# Altium schematic sheet MCU.SchDoc
size A3; SheetNumber: 1; SheetTotal: 2
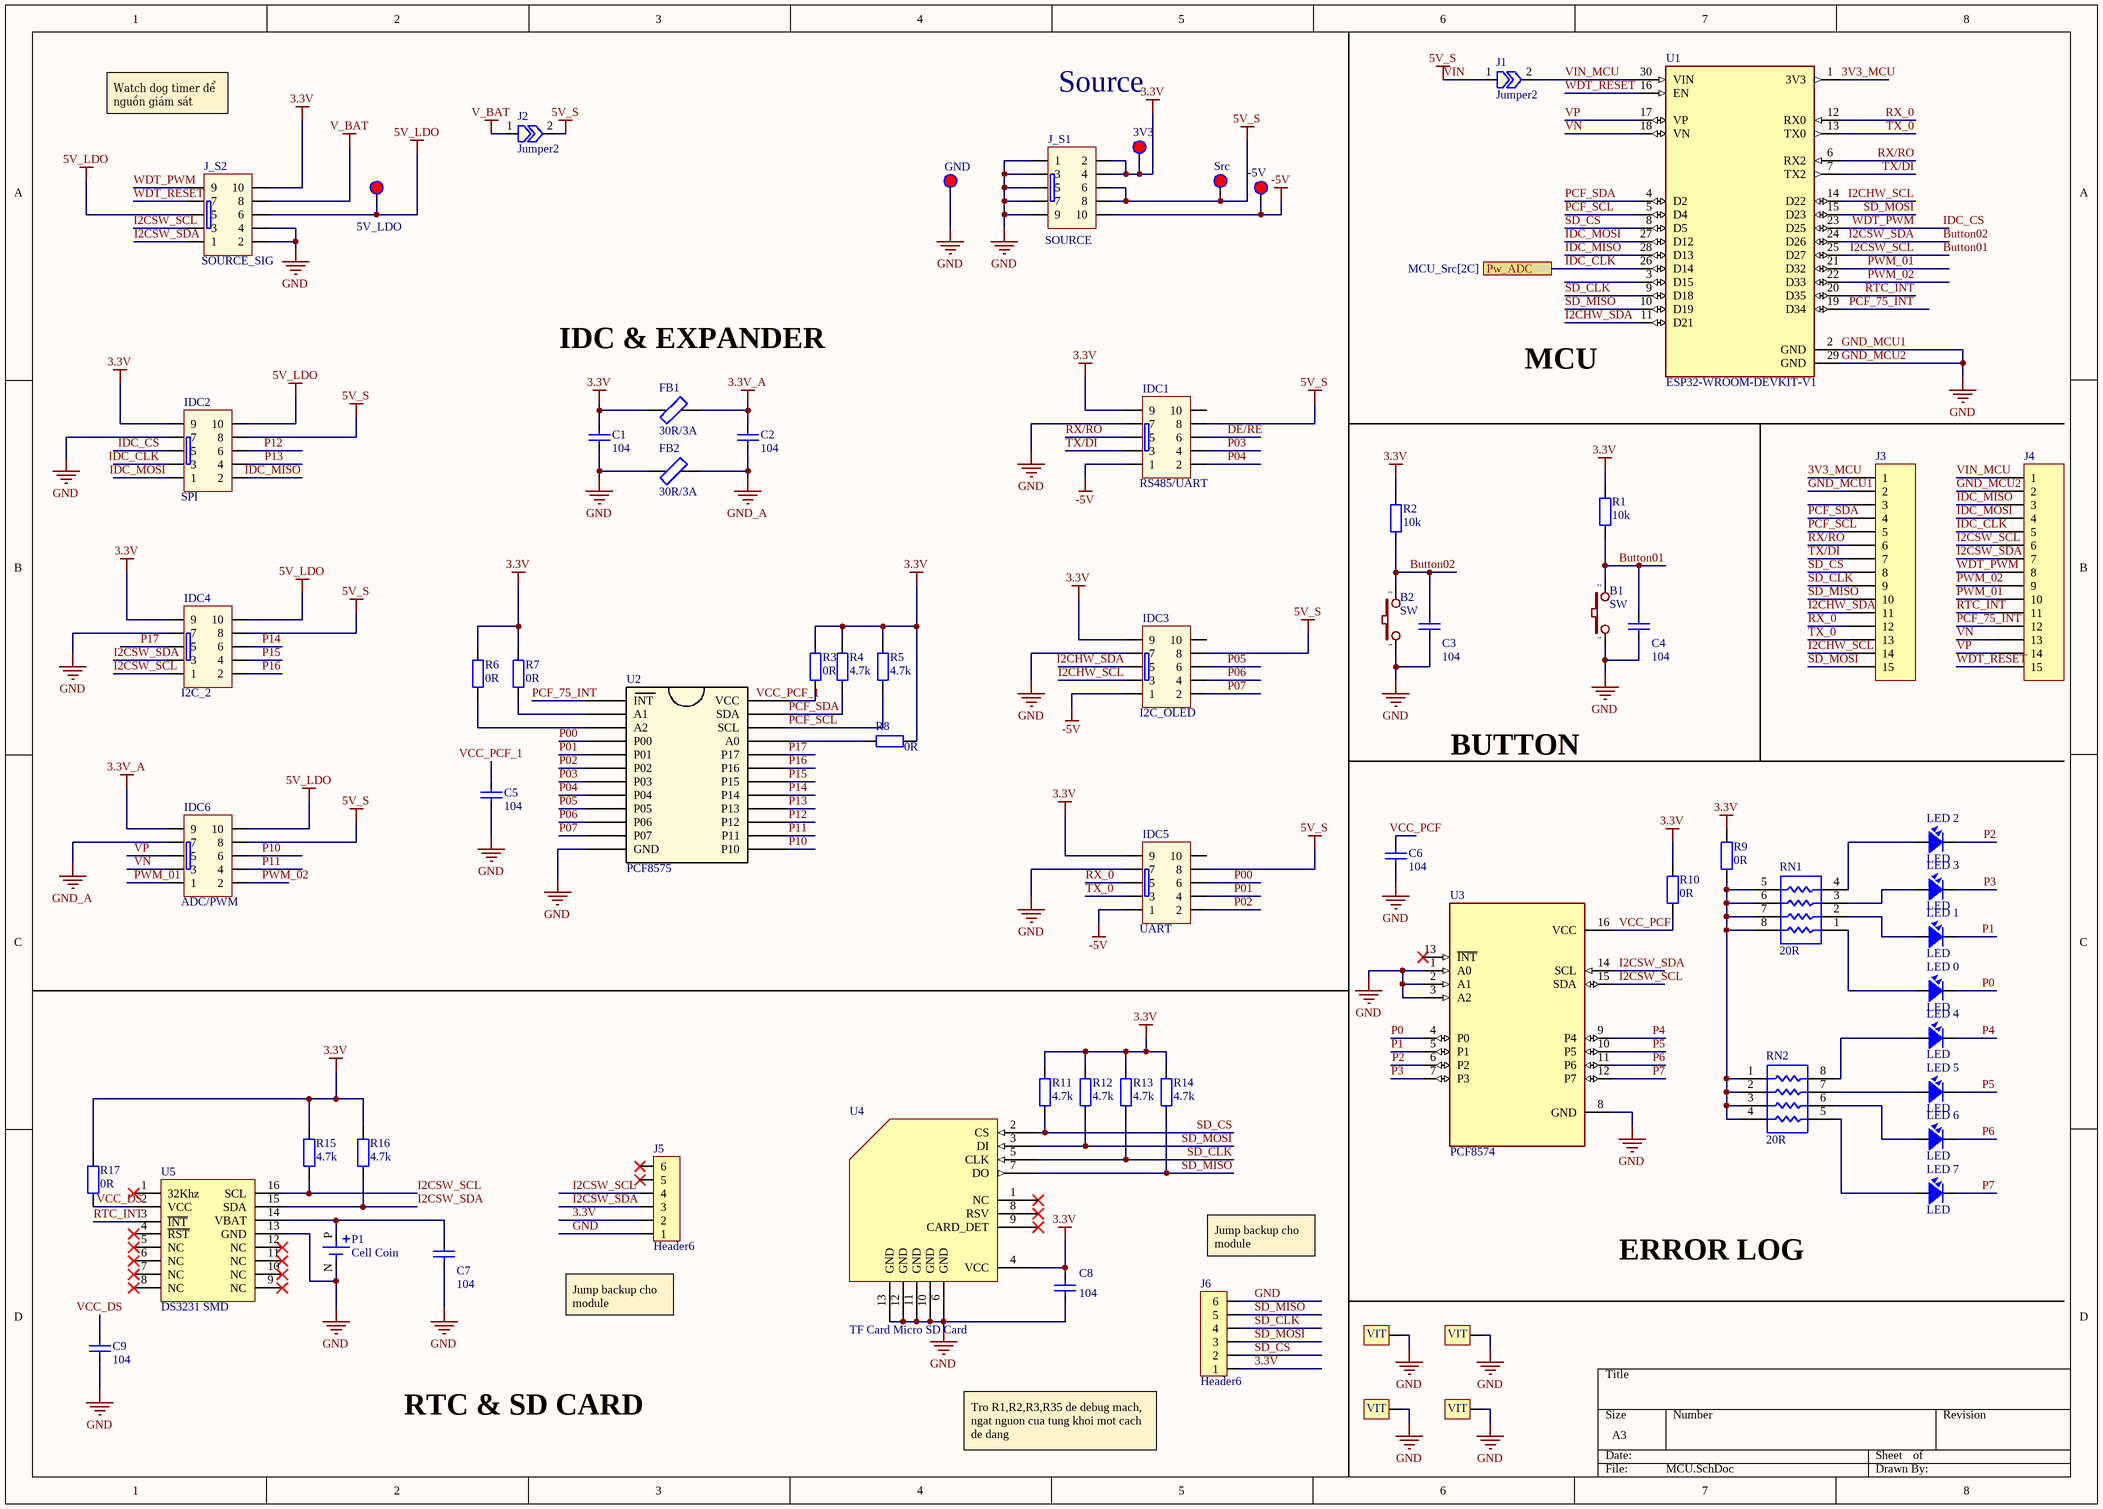
[diagram p0: MCU.SchDoc]

## Parts
B1  SW  [BUTTON NGHIENG]
B2  SW  [BUTTON NGHIENG]
C1  104  [CAP_0603]
C2  104  [CAP_0603]
C3  104  [CAP_0603]
C4  104  [CAP_0603]
C5  104  [CAP_0603]
C6  104  [CAP_0603]
C7  104  [CAP_0603]
C8  104  [CAP_0603]
C9  104  [CAP_0603]
FB1  30R/3A  [RES-SMD-0603]
FB2  30R/3A  [RES-SMD-0603]
IDC1  RS485/UART  [IDC10]
IDC2  SPI  [IDC10]
IDC3  I2C_OLED  [IDC10]
IDC4  I2C_2  [IDC10]
IDC5  UART  [IDC10]
IDC6  ADC/PWM  [IDC10]
J1  Jumper2  [JUMPER2]  (net tie, no BOM)
J2  Jumper2  [RES-SMD-0402]  (net tie, no BOM)
J3  JP15  [JP15-C1T]  (value not drawn)
J4  JP15  [JP15-C1T]  (value not drawn)
J5  Header6  [Header6]
J6  Header6  [JP6]
J_S1  SOURCE  [IDC10]
J_S2  SOURCE_SIG  [IDC10]
LED_0  LED  [LED-0805-Blue]
LED_1  LED  [LED-0805-Blue]
LED_2  LED  [LED-0805-Blue]
LED_3  LED  [LED-0805-Blue]
LED_4  LED  [LED-0805-Blue]
LED_5  LED  [LED-0805-Blue]
LED_6  LED  [LED-0805-Blue]
LED_7  LED  [LED-0805-Blue]
P1  Cell Coin  [S8411 - 45R]
R1  10k  [RES-SMD-0603]
R2  10k  [RES-SMD-0603]
R3  0R  [RES-SMD-0603]
R4  4.7k  [RES-SMD-0603]
R5  4.7k  [RES-SMD-0603]
R6  0R  [RES-SMD-0603]
R7  0R  [RES-SMD-0603]
R8  0R  [RES-SMD-0603]
R9  0R  [RES-SMD-0603]
R10  0R  [RES-SMD-0603]
R11  4.7k  [RES-SMD-0603]
R12  4.7k  [RES-SMD-0603]
R13  4.7k  [RES-SMD-0603]
R14  4.7k  [RES-SMD-0603]
R15  4.7k  [RES-SMD-0603]
R16  4.7k  [RES-SMD-0603]
R17  0R  [RES-SMD-0603]
RN1  20R  [RN4_Dual]
RN2  20R  [RN4_Dual]
TP1  3V3  [Testpoint 50ml]  (net tie, no BOM)
TP2  Src  [Testpoint 50ml]  (net tie, no BOM)
TP3  5V_LDO  [Testpoint 50ml]  (net tie, no BOM)
TP4  GND  [Testpoint 50ml]  (net tie, no BOM)
TP5  -5V  [Testpoint 50ml]  (net tie, no BOM)
U1  ESP32-WROOM-DEVKIT-V1  [ESP32-DEVKIT-V1]
U2  PCF8575  [TSSOP-24]
U3  PCF8574  [SOIC 16 W]
U4  TF Card Micro SD Card  [SD Card TF Card Micro]
U5  DS3231 SMD  [SOIC 16 W]
VIT1  1  [Screw Hole 4mm]  (value not drawn)  (net tie, no BOM)
VIT2  1  [Screw Hole 4mm]  (value not drawn)  (net tie, no BOM)
VIT3  1  [Screw Hole 4mm]  (value not drawn)  (net tie, no BOM)
VIT4  1  [Screw Hole 4mm]  (value not drawn)  (net tie, no BOM)

## Ports
Pw_ADC (see MCU_Src[2C])

## Nets
3.3V: C1.2 C8.2 FB1.1 IDC1.9 IDC2.9 IDC3.9 IDC4.9 IDC5.9 J5.2 J6.1 J_S1.2 J_S1.4 J_S2.10 R1.1 R2.1 R3.1 R4.1 R5.1 R6.2 R7.2 R8.1 R9.2 R10.1 R11.1 R12.1 R13.1 R14.1 R15.1 R16.1 R17.1 TP1.1 U4.4(VCC)
3.3V_A: C2.2 FB1.2 IDC6.9
5V_LDO: IDC2.10 IDC4.10 IDC6.10 J_S2.5 J_S2.6 TP3.1
-5V: IDC1.1 IDC3.1 IDC5.1 J_S1.10 TP5.1
GND: B1.1 B2.1 C1.1 C3.1 C4.1 C5.1 C6.1 C7.1 C8.1 C9.1 FB2.1 IDC1.7 IDC2.7 IDC3.7 IDC4.7 IDC5.7 J3.2 J4.2 J5.1 J6.6 J_S1.1 J_S1.3 J_S1.5 J_S1.7 J_S1.9 J_S2.2 J_S2.4 P1.N(NEG) TP4.1 U1.2(GND) U1.29(GND) U2.12(GND) U3.1(A0) U3.2(A1) U3.3(A2) U3.8(GND) U4.6(GND) U4.10(GND) U4.11(GND) U4.12(GND) U4.13(GND) U5.13(GND) VIT1.VIT1 VIT2.VIT1 VIT3.VIT1 VIT4.VIT1  [also labelled GND_MCU1, GND_MCU2]
GND_A: C2.1 FB2.2 IDC6.7
V_BAT: J2.1 J_S2.8
VIN: IDC1.8 IDC2.8 IDC3.8 IDC4.8 IDC5.8 IDC6.8 J1.1 J2.2 J_S1.6 J_S1.8 TP2.1  [also labelled 5V_S]
3V3_MCU: J3.1 U1.1(3V3)
Button01: B1.2 C4.2 IDC4.1 J4.6 J5.4 J_S2.3 R1.2 R15.2 U1.25(D27) U3.15(SDA) U5.16(SCL)  [also labelled I2CSW_SCL]
Button02: B2.2 C3.2 IDC4.3 J4.7 J5.3 J_S2.1 R2.2 R16.2 U1.24(D26) U3.14(SCL) U5.15(SDA)  [also labelled I2CSW_SDA]
DE/RE: IDC1.6
I2CHW_SCL: IDC3.3 J3.14 U1.14(D22)
I2CHW_SDA: IDC3.5 J3.11 U1.11(D21)
IDC_CLK: IDC2.3 J4.5 U1.26(D14) ; port Pw_ADC
IDC_CS: IDC2.5 J4.8 J_S2.9 U1.23(D25)  [also labelled WDT_PWM]
IDC_MISO: IDC2.2 J4.3 U1.28(D13)
IDC_MOSI: IDC2.1 J4.4 U1.27(D12)
P00: IDC5.6 U2.4(P00)
P0: LED_0.2 U3.4(P0)
P01: IDC5.4 U2.5(P01)
P1: LED_1.2 U3.5(P1)
P02: IDC5.2 U2.6(P02)
P2: LED_2.2 U3.6(P2)
P03: IDC1.4 U2.7(P03)
P3: LED_3.2 U3.7(P3)
P04: IDC1.2 U2.8(P04)
P4: LED_4.2 U3.9(P4)
P05: IDC3.6 U2.9(P05)
P5: LED_5.2 U3.10(P5)
P06: IDC3.4 U2.10(P06)
P6: LED_6.2 U3.11(P6)
P07: IDC3.2 U2.11(P07)
P7: LED_7.2 U3.12(P7)
P10: IDC6.6 U2.13(P10)
P11: IDC6.4 U2.14(P11)
P12: IDC2.6 U2.15(P12)
P13: IDC2.4 U2.16(P13)
P14: IDC4.6 U2.17(P14)
P15: IDC4.4 U2.18(P15)
P16: IDC4.2 U2.19(P16)
P17: IDC4.5 U2.20(P17)
PCF_75_INT: J4.12 U1.19(D34) U2.1(INT)
PCF_SCL: J3.5 R5.2 U1.5(D4) U2.22(SCL)
PCF_SDA: J3.4 R4.2 U1.4(D2) U2.23(SDA)
PWM_01: IDC6.1 J4.10 U1.21(D32)
PWM_02: IDC6.2 J4.9 U1.22(D33)
RTC_INT: J4.11 U1.20(D35) U5.3(~{INT})
RX/RO: IDC1.5 J3.6 U1.6(RX2)
RX_0: IDC5.5 J3.12 U1.12(RX0)
SD_CLK: J3.9 J6.4 R13.2 U1.9(D18) U4.5(CLK)
SD_CS: J3.8 J6.2 R11.2 U1.8(D5) U4.2(CS)
SD_MISO: J3.10 J6.5 R14.2 U1.10(D19) U4.7(DO)
SD_MOSI: J3.15 J6.3 R12.2 U1.15(D23) U4.3(DI)
TX/DI: IDC1.3 J3.7 U1.7(TX2)
TX_0: IDC5.3 J3.13 U1.13(TX0)
VCC_DS: C9.2 R17.2 U5.2(VCC)
VCC_PCF: C6.2 R10.2 U3.16(VCC)
VCC_PCF_1: C5.2 R3.2 U2.24(VCC)
VIN_MCU: J1.2 J4.1 U1.30(VIN)
VN: IDC6.3 J4.13 U1.18(VN)
VP: IDC6.5 J4.14 U1.17(VP)
WDT_RESET: J4.15 J_S2.7 U1.16(EN)
NetC7_2: C7.2 P1.P(POS) U5.14(VBAT)
NetLED_0_1: LED_0.1 RN1.1
NetLED_1_1: LED_1.1 RN1.2
NetLED_2_1: LED_2.1 RN1.4
NetLED_3_1: LED_3.1 RN1.3
NetLED_4_1: LED_4.1 RN2.8
NetLED_5_1: LED_5.1 RN2.7
NetLED_6_1: LED_6.1 RN2.6
NetLED_7_1: LED_7.1 RN2.5
NetR6_1: R6.1 U2.3(A2)
NetR7_1: R7.1 U2.2(A1)
NetR8_2: R8.2 U2.21(A0)
NetR9_1: R9.1 RN1.5 RN1.6 RN1.7 RN1.8 RN2.1 RN2.2 RN2.3 RN2.4

Not connected (* = marked no-connect by the designer): IDC1 10; IDC3 10; IDC5 10; J3 3; J5 5* 6*; U1 3(D15); U3 13(~{INT})*; U4 1(NC)* 8(RSV)* 9(CARD_DET)*; U5 1(32Khz)* 4(~{RST})* 5(NC)* 6(NC)* 7(NC)* 8(NC)* 9(NC)* 10(NC)* 11(NC)* 12(NC)*

## Notes on the sheet
- Watch dog timer để nguồn giám sát MCU
- Source
- IDC & EXPANDER
- MCU
- BUTTON
- (near J6) Jump backup cho module
- ERROR LOG
- (near J5) Jump backup cho module
- RTC & SD CARD
- Tro R1,R2,R3,R35 de debug mach, ngat nguon cua tung khoi mot cach de dang

## Library data of the parts
B1 B2 = SW2: Switch button 2 pin; Value: SW chip 2 pin
C1-C9 = CapSMD: Capacitor SMD 0603; Value: 33p; Published: 8-Jun-2000; LatestRevisionDate: 17-Jul-2002; LatestRevisionNote: Re-released for DXP Platform.; PackageReference: RAD-0.3; Publisher: Altium Limited
FB1 FB2 = Ferrit Bead: FB SMD 0603
IDC1-IDC6 J_S1 J_S2 = IDC 5X2: Value: Header 5x2
J1 J2 = Jumper2: Jumper, 2-Pin
J3 J4 = JP15: WR-PHD 2.54 mm Angled Socket Header; Manufacturer: W¨¹rth Elektronik eiSos GmbH; partNo: 613015143121; ComponentLink1 Description: Manufacturer; ComponentLink2 Description: Datasheet; NoPins: 15; Created Date: 29 March 2013; ComponentLink1URL: http://www.we-online.com; ComponentLink2URL: http://katalog.we-online.de/em/datasheet/6130xx143121.pdf; Created by: Karrer Zheng
J5 J6 = Header6: Header IDC, 6 x 1 Pin Vertical 2.54mm Pitch (Non-Boxed, Male); Manufacturer: W¨¹rth Elektronik eiSos GmbH; partNo: 613002143121; ComponentLink1 Description: Manufacturer; ComponentLink2 Description: Datasheet; NoPins: 02; Created Date: 29 March 2013; ComponentLink1URL: http://www.we-online.com; ComponentLink2URL: http://katalog.we-online.de/em/datasheet/6130xx143121.pdf; Created by: Karrer Zheng
LED_0-LED_7 = LED: LED Single colour Green and Red; Value: LED 3 ly Single Colour
P1 = S8411-45R: Coin Cell Battery Retainer, Horizontal SMT, for CR1220 Coin Cell Batteries, Tape & Reeled
R1-R17 = Resistor - SMD: Resistor SMD 0603; Manufacturer: Generic Components; Class: Passive; Published: 08/06/2000; Publisher: Altium Hobart Technology Centre
RN1 RN2 = RN4_Dual: RN4 Dual resistor
TP1-TP5 = Testpoint
U1 = ESP32-WROOM-DEVKIT-V1: EVAL BOARD FOR ESP-WROOM-32
U2 = PCF8575DW: https://shopee.vn/Set-5-Linh-Ki%E1%BB%87n-%C4%90i%E1%BB%87n-T%E1%BB%AD-Pcf8575Ts-Pcf8575-Ssop-24-Pcf8575Pwr-Pf575-Tssop-24-i.354017206.7468807321?extraParams=%7B%22display_model_id%22%3A25981768845%2C%22model_selection_logic%22%3A3%7D&sp_atk=da7bae07-f57c-4d15-a7da-c831ba5df15d&xptdk=da7bae07-f57c-4d15-a7da-c831ba5df15d
U3 = PCF8574: I2C PORT EXPANDER; Manufacturer Part Number: PCF8574T/3,512; Manufacturer: NXP Semiconductors; Includes: POR; Interface: I²C; Interrupt Output: Yes; Number of I /O: 8; Voltage - Supply: 2.5 V ~ 6 V; Frequency - Clock: 100KHz; Supplier 1: Digi-Key; Supplier Part Number 1: 568-1076-5-ND; Package / Case: 16-SOIC (7.5mm Width); Category: Integrated Circuits (ICs); Supplier Part Number: 568-1076-5-ND; Operating Temperature: -40°C ~ 85°C; Packaging: Tube; RoHS: RoHS Compliant; Supplier: Digi-Key
U4 = TF Card Micro SD Card: https://linhkien.cxtvn.com/5532-mr01a-01211-tf-card-micro-sd-card.html
U5 = DS3231 SMD: SOIC
VIT1-VIT4 = VIT: Oc Vit